# Altium schematic sheet WRTnode.SchDoc: WRTnode
size A4; Author: SchumyHao; DocumentNumber: 7; Revision: V01; SheetNumber: 7; SheetTotal: 7
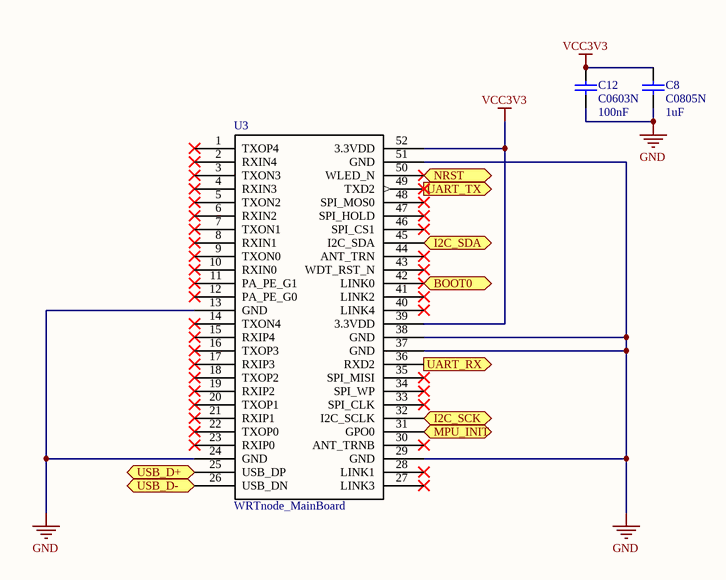
[diagram p0: WRTnode.SchDoc]

## Parts
C8  C0805N  value 1uF  [C0805N]
C12  C0603N  value 100nF  [C0603N]
U3  WRTnode_MainBoard  [WRTnode_MainBoard_DIP26*2]

## Ports
BOOT0, I2C_SCK (bidir), I2C_SDA (bidir), MPU_INIT (bidir), NRST, UART_RX (in), UART_TX (out), USB_D+ (bidir), USB_D- (bidir)

## Nets
GND: C8.1 C12.1 U3.13(GND) U3.24(GND) U3.29(GND) U3.37(GND) U3.38(GND) U3.51(GND)
VCC3V3: C8.2 C12.2 U3.39(3.3VDD) U3.52(3.3VDD)
BOOT0: U3.42(LINK0) ; port BOOT0
I2C_SCK: U3.32(I2C_SCLK) ; port I2C_SCK
I2C_SDA: U3.45(I2C_SDA) ; port I2C_SDA
MPU_INIT: U3.31(GPO0) ; port MPU_INIT
NRST: U3.50(WLED_N) ; port NRST
UART_RX: U3.36(RXD2) ; port UART_RX
UART_TX: U3.49(TXD2) ; port UART_TX
USB_D+: U3.25(USB_DP) ; port USB_D+
USB_D-: U3.26(USB_DN) ; port USB_D-

Not connected (* = marked no-connect by the designer): U3 1(TXOP4)* 2(RXIN4)* 3(TXON3)* 4(RXIN3)* 5(TXON2)* 6(RXIN2)* 7(TXON1)* 8(RXIN1)* 9(TXON0)* 10(RXIN0)* 11(PA_PE_G1)* 12(PA_PE_G0)* 14(TXON4)* 15(RXIP4)* 16(TXOP3)* 17(RXIP3)* 18(TXOP2)* 19(RXIP2)* 20(TXOP1)* 21(RXIP1)* 22(TXOP0)* 23(RXIP0)* 27(LINK3)* 28(LINK1)* 30(ANT_TRNB)* 33(SPI_CLK)* 34(SPI_WP)* 35(SPI_MISI)* 40(LINK4)* 41(LINK2)* 43(WDT_RST_N)* 44(ANT_TRN)* 46(SPI_CS1)* 47(SPI_HOLD)* 48(SPI_MOS0)*

## Notes on the sheet
- Title
- Size:
- Date:
- A4
- Number:
- Time:
- Revision:
- Sheet
- of
- File:

## Library data of the parts
C8 C12 = Cap: Capacitor; Published: 8-Jun-2000; LatestRevisionDate: 17-Jul-2002; LatestRevisionNote: Re-released for DXP Platform.; PackageReference: RAD-0.3; Publisher: Altium Limited